# EAGLE board Timer_CMD_REV2 (EAGLE 7.0.0), part 1 of 2
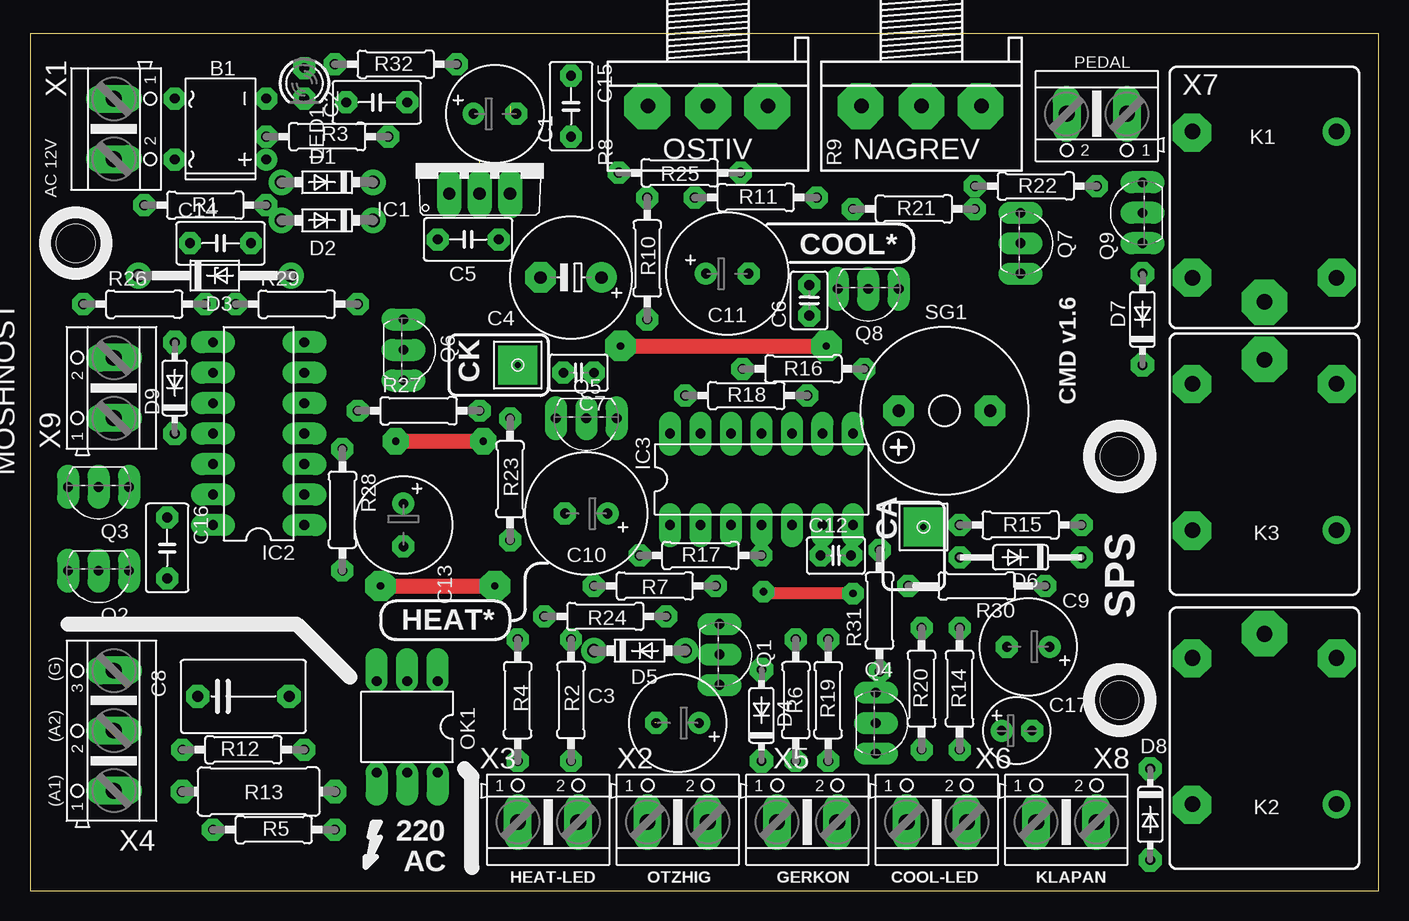
[diagram p1: board, top side]
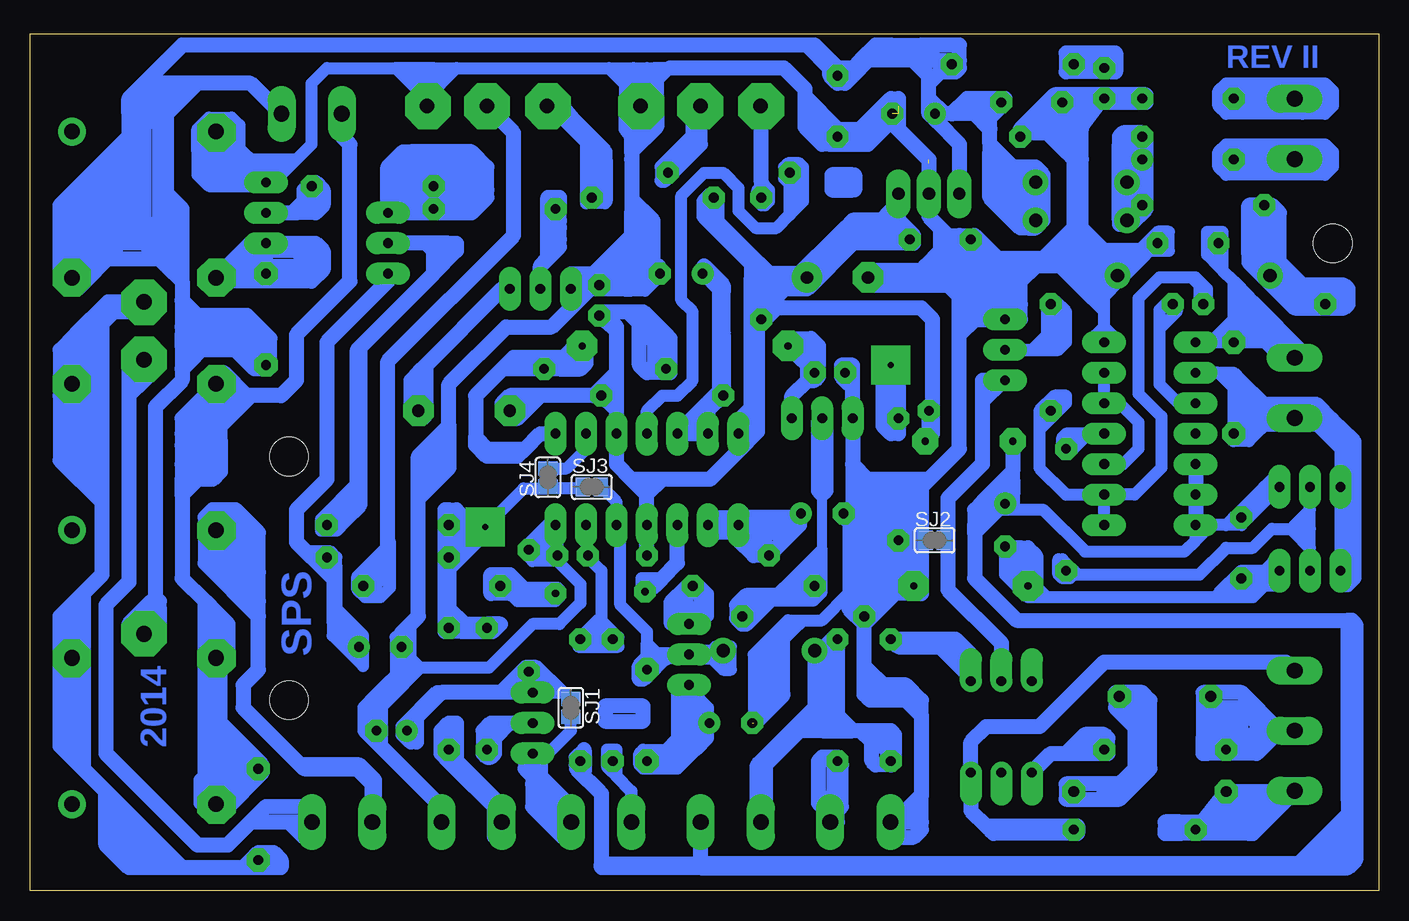
[diagram p2: board, bottom side, seen from below]

Size 112.38 x 71.43 mm. Coordinates in mm from the lower left corner, seen from the top.
Outline: 0,0 112.38,0 112.38,71.43 0,71.43 0,0
Copper layers (1*16): Top 0.035mm / dielectric 1.5mm / Bottom 0.035mm
Design rules "default *": minimum track width 10mil, minimum drill 24mil, track to track 8mil, track to pad 8mil, pad to pad 8mil, via to via 8mil, smd to smd 8mil, copper to edge 40mil, drill to drill 8mil, minimum pad ring 20mil, minimum via ring 8mil, stop-mask expansion 4mil, vias tented up to drill 0mil, thermal gap 10mil
Holes 3.2 mm at 3.81,53.98 90.8,36.2 90.8,15.88

## Footprints (pad centres in the part's own frame; a part is rotated, then mirrored left to right if it is on the bottom)
DB = drill 0.813: + -2.54,-3.81 | drill 0.813 octagon: - 2.54,-3.81; AC1 2.54,3.81; AC2 -2.54,3.81
E3,5-8 = drill 0.813 pad 1.6: + -1.778,0 | drill 0.813 pad 1.6 octagon: - 1.778,0
C050-035X075 = drill 0.813 octagon: 1 -2.54,0; 2 2.54,0
E5-10,5 = drill 1.016 pad 2.54: + -2.54,0 | drill 1.016 pad 2.54 octagon: - 2.54,0
C025-030X050 = drill 0.813 octagon: 1 -1.27,0; 2 1.27,0
C075-063X106 = drill 0.914 octagon: 1 -3.81,0; 2 3.81,0
E3,5-10 = drill 0.813 pad 1.6: + -1.778,0 | drill 0.813 pad 1.6 octagon: - 1.778,0
E2,5-6 = drill 0.813 pad 1.6: + -1.27,0 | drill 0.813 pad 1.6 octagon: - 1.27,0
DO41-7.6 = drill 1.1 pad 1.7: A 3.81,0; C -3.81,0
DO41Z12 = drill 1.118: A 6.35,0; C -6.35,0
DO35-7SQ = drill 0.813 pad 1.93 octagon: A 3.81,0; C -3.81,0
DO35-10_SQ = drill 0.813 pad 1.778 octagon: A 5.08,0; C -5.08,0
4MM-PAD-SQUARE = drill 0.5 pad 3.251 square: B2,8 0,0
TO220V = drill 1.016 long: 1 -2.54,-2.54; 2 0,-2.54; 3 2.54,-2.54
DIL14 = drill 0.813 long: 1 -7.62,-3.81; 2 -5.08,-3.81; 3 -2.54,-3.81; 4 0,-3.81; 5 2.54,-3.81; 6 5.08,-3.81; 7 7.62,-3.81; 8 7.62,3.81; 9 5.08,3.81; 10 2.54,3.81; 11 0,3.81; 12 -2.54,3.81; 13 -5.08,3.81; 14 -7.62,3.81
JS-M = drill 1.3: 1 6.7,6; 2 6.7,-6; C 8.7,0; NC -5.5,-6; NO -5.5,6
LED3MM = drill 0.813 octagon: A -1.27,0; K 1.27,0
DIL06 = drill 0.813 offset: 1 -2.54,-3.81; 2 0,-3.81; 3 2.54,-3.81; 4 2.54,3.81; 5 0,3.81; 6 -2.54,3.81
TO92-EBC = drill 0.813 long: B 0,-1.27; C -2.54,-1.27; E 2.54,-1.27
0207/10 = drill 0.813 octagon: 1 -5.08,0; 2 5.08,0
3RP/1610N = drill 1.2 pad 2.184: 1 -5,0; 2 0,0; 3 5,0
0411/12 = drill 0.914 octagon: 1 -6.35,0; 2 6.35,0
0207/11 = drill 0.813 octagon: 1 -6.35,0; 2 5.08,0
F/CM12P = drill 1.016 pad 2.54 octagon: + 3.81,0; - -3.81,0
SJ = smd 1.168 x 1.6: 1 -0.762,0; 2 0.762,0
AK500/2 = drill 1.321 long: 1 -2.515,0; 2 2.515,0
AK500/3 = drill 1.321 long: 1 -5.004,0; 2 0,0; 3 5.004,0

## Placement (x,y rotation side)
B1  DB107  [DB]  15.88,63.5 90 top
C1  470uF 25v  [E3,5-8]  38.73,64.77 0 top
C2  100n  [C050-035X075]  28.89,65.72 180 top
C3  33uF 16v  [E3,5-8]  53.98,13.97 180 top
C4  1000uf 16v  [E5-10,5]  45.09,51.12 180 top
C5  100n  [C050-035X075]  36.51,54.29 180 top
C6  100n  [C025-030X050]  64.93,49.21 90 top
C7  100n  [C025-030X050]  45.72,43.18 180 top
C8  0.01uF 400v  [C075-063X106]  17.78,16.19 0 top
C9  33uF 16v  [E3,5-8]  83.19,20.32 180 top
C10  HEAT*  [E3,5-10]  46.36,31.43 180 top
C11  COOL*  [E3,5-10]  58.1,51.43 0 top
C12  100n  [C025-030X050]  67.15,27.94 0 top
C13  220uF 16v  [E3,5-8]  31.12,30.48 270 top
C14  150n  [C050-035X075]  15.88,53.98 0 top
C15  100n  [C050-035X075]  45.09,65.41 270 top
C16  100n  [C050-035X075]  11.43,28.58 270 top
C17  33uf 16v  [E2,5-6]  82.23,13.33 0 top
D1  1N5819  [DO41-7.6]  24.77,59.05 180 top
D2  1N5819  [DO41-7.6]  24.77,55.88 180 top
D3  9V1  [DO41Z12]  15.4,51.28 0 top
D4  1N4148  [DO35-7SQ]  60.96,14.61 90 top
D5  1N5819  [DO41-7.6]  50.8,20 0 top
D6  1N4148SQ  [DO35-10_SQ]  82.55,27.78 180 top
D7  1N4148  [DO35-7SQ]  92.71,47.62 90 top
D8  1N4148  [DO35-7SQ]  93.34,6.35 270 top
D9  1N4148  [DO35-7SQ]  12.07,41.91 90 top
DRILEGEND  [DRILEGEND]  117.27,67.2 0 top  (outside the outline)
H1  COOL  [4MM-PAD-SQUARE]  40.64,43.81 0 top
H2  COOL  [4MM-PAD-SQUARE]  74.45,30.32 0 top
IC1  7812TV  [TO220V]  37.47,60.64 0 top
IC2  4011N  [DIL14]  19.05,38.1 90 top
IC3  NE556  [DIL14]  60.96,34.29 0 top
K1  JS-M1-12V-4  [JS-M]  102.87,57.78 270 top
K2  JS-M1-12V-4  [JS-M]  102.87,12.7 90 top
K3  JS-M1-12V-4  [JS-M]  102.87,35.56 90 top
LED1  [LED3MM]  22.86,67.31 270 top
OK1  MOC3052  [DIL06]  31.43,13.65 180 top
Q1  BC327-40  [TO92-EBC]  58.74,19.69 270 top
Q2  BC327-40  [TO92-EBC]  5.72,25.4 180 top
Q3  BC337-40  [TO92-EBC]  5.72,32.38 180 top
Q4  BC327-40  [TO92-EBC]  71.75,13.97 270 top
Q5  BC337-40  [TO92-EBC]  46.36,38.1 180 top
Q6  BC327-40  [TO92-EBC]  32.38,45.09 270 top
Q7  BC327-40  [TO92-EBC]  83.82,53.98 270 top
Q8  BC337-40  [TO92-EBC]  69.85,48.89 180 top
Q9  BC337-40  [TO92-EBC]  91.44,56.52 90 top
R1  1k  [0207/10]  14.61,57.15 180 top
R2  1k  [0207/10]  45.09,15.88 90 top
R3  3.9k  [0207/10]  24.77,62.86 0 top
R4  510  [0207/10]  40.64,15.88 270 top
R5  330  [0207/10]  20.32,5.08 0 top
R6  47  [0207/10]  63.82,15.88 90 top
R7  1k  [0207/10]  52.07,25.4 0 top
R8  100k  [3RP/1610N]  56.52,65.41 180 top
R9  100k  [3RP/1610N]  74.3,65.41 180 top
R10  1k  [0207/10]  51.44,52.7 90 top
R11  1k  [0207/10]  60.48,57.78 0 top
R12  390  [0207/10]  17.78,11.75 0 top
R13  39  [0411/12]  19.05,8.26 180 top
R14  1k  [0207/10]  77.47,16.83 90 top
R15  1k  [0207/10]  82.55,30.48 180 top
R16  10k  [0207/10]  64.45,43.5 180 top
R17  10k  [0207/10]  55.88,27.94 0 top
R18  10k  [0207/10]  59.69,41.27 0 top
R19  1k  [0207/10]  66.52,15.88 270 top
R20  1k  [0207/10]  74.3,16.83 90 top
R21  1k  [0207/10]  73.66,56.83 0 top
R22  1k  [0207/10]  83.82,58.74 180 top
R23  1k  [0207/10]  40.01,34.29 90 top
R24  10k  [0207/10]  47.94,22.86 180 top
R25  330*  [0207/10]  54.13,59.85 0 top
R26  10k  [0207/10]  9.53,48.89 0 top
R27  39k  [0207/10]  32.38,40 0 top
R28  3,9k  [0207/10]  26.04,31.75 270 top
R29  1k  [0207/10]  22.23,48.89 0 top
R30  1k  [0207/11]  78.26,25.4 180 top
R31  10k  [0207/10]  70.8,23.34 90 top
R32  1k  [0207/10]  30.48,68.9 180 top
SG1  F/CM12P  [F/CM12P]  76.2,40 180 top
SJ1  [SJ]  67.31,15.24 270 bottom
SJ2  [SJ]  36.99,29.21 0 bottom
SJ3  [SJ]  65.56,33.66 0 bottom
SJ4  [SJ]  69.22,34.45 90 bottom
X1  AC 12V  [AK500/2]  6.99,63.5 270 top
X2  OTZIG  [AK500/2]  53.98,5.71 0 top
X3  LED-HEAT  [AK500/2]  43.18,5.71 0 top
X4  TRIAC  [AK500/3]  6.99,13.33 90 top
X5  GERKON  [AK500/2]  64.77,5.71 0 top
X6  LED-COOL  [AK500/2]  75.56,5.71 0 top
X7  PEDAL  [AK500/2]  88.9,64.77 180 top
X8  KLAPAN  [AK500/2]  86.36,5.71 0 top
X9  POWER 100k  [AK500/2]  6.99,41.91 90 top